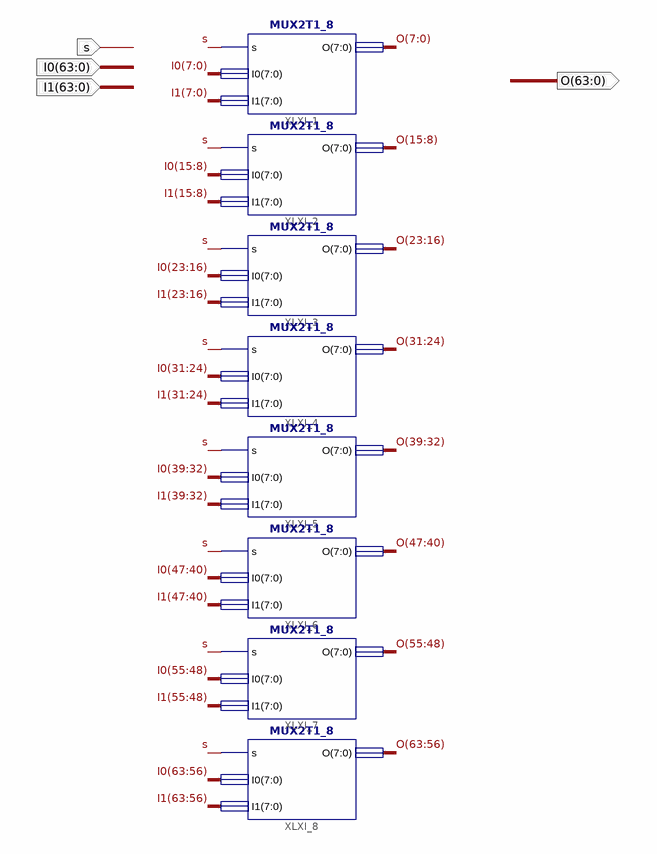
[diagram p0: schematic sheet 1]
// Xilinx ISE schematic MUX2T1_64.sch (kintex7) as structural Verilog: 8 symbols, 4 ports
module MUX2T1_64 (
  input  s,
  input  [63:0] I0,
  input  [63:0] I1,
  output [63:0] O
);

  MUX2T1_8 XLXI_1 (.s(s), .I0(I0[7:0]), .I1(I1[7:0]), .O(O[7:0]));
  MUX2T1_8 XLXI_2 (.s(s), .I0(I0[15:8]), .I1(I1[15:8]), .O(O[15:8]));
  MUX2T1_8 XLXI_3 (.s(s), .I0(I0[23:16]), .I1(I1[23:16]), .O(O[23:16]));
  MUX2T1_8 XLXI_4 (.s(s), .I0(I0[31:24]), .I1(I1[31:24]), .O(O[31:24]));
  MUX2T1_8 XLXI_5 (.s(s), .I0(I0[39:32]), .I1(I1[39:32]), .O(O[39:32]));
  MUX2T1_8 XLXI_6 (.s(s), .I0(I0[47:40]), .I1(I1[47:40]), .O(O[47:40]));
  MUX2T1_8 XLXI_7 (.s(s), .I0(I0[55:48]), .I1(I1[55:48]), .O(O[55:48]));
  MUX2T1_8 XLXI_8 (.s(s), .I0(I0[63:56]), .I1(I1[63:56]), .O(O[63:56]));
endmodule
